# Altium schematic sheet EqualizerChannel.SchDoc
size A4; DocumentNumber: 1; SheetNumber: 1; SheetTotal: 4
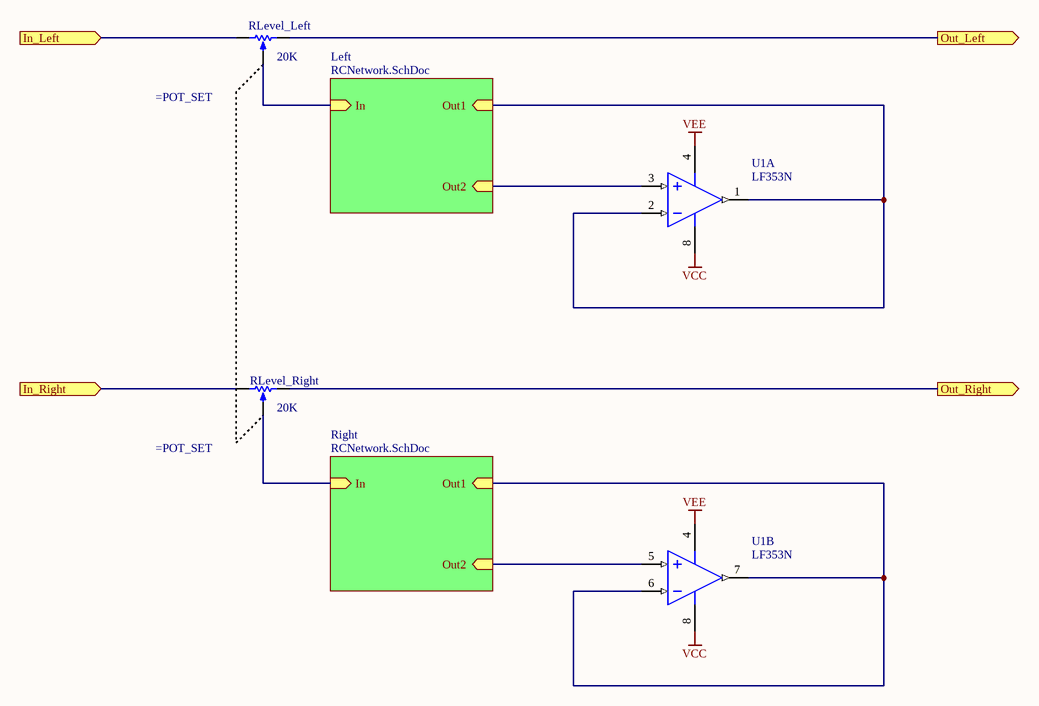
[diagram p0: EqualizerChannel.SchDoc]

## Parts
RLevel_Left  value 20K  [VR5]  (hidden comment: RPot)
RLevel_Right  value 20K  [VR5]  (hidden comment: RPot)
U1  LF353N  [N08E]  (parts A,B of 2)

## Sub-sheets
Left = RCNetwork.SchDoc: In (in), Out1 (in), Out2 (in)
Right = RCNetwork.SchDoc: In (in), Out1 (in), Out2 (in)

## Ports
In_Left (in), In_Right (in), Out_Left (out), Out_Right (out)

## Nets
VCC: U1.8(V+)
VEE: U1.4(V-)
In_Left: RLevel_Left.1(TOP) ; port In_Left
In_Right: RLevel_Right.1(TOP) ; port In_Right
Out_Left: RLevel_Left.2(BOT) ; port Out_Left
Out_Right: RLevel_Right.2(BOT) ; port Out_Right
NetRLevel_Left_3: RLevel_Left.3(TAP) ; sheet Left/In
NetRLevel_Right_3: RLevel_Right.3(TAP) ; sheet Right/In
NetU1_1: U1.1(OUTA) U1.2(INA-) ; sheet Left/Out1
NetU1_3: U1.3(INA+) ; sheet Left/Out2
NetU1_5: U1.5(INB+) ; sheet Right/Out2
NetU1_6: U1.6(INB-) U1.7(OUTB) ; sheet Right/Out1

## Notes on the sheet
- Title
- Size:
- Date:
- A4
- Number:
- Time:
- Revision:
- Sheet
- of
- File:

## Library data of the parts
RLevel_Left RLevel_Right = RPot: Potentiometer; Sim Note: Enter the Resistance value and the set point into parameter fields.; Published: 8-Jun-2000; LatestRevisionDate: 17-Jul-2002; LatestRevisionNote: Re-released for DXP Platform.; Publisher: Altium Limited; Set Position: =POT_SET
U1 = LF353N: Wide Bandwidth Dual JFET Input Operational Amplifier, 8-pin MDIP; Manufacturer: National Semiconductor; PackageTopMarking: NSUZXYTTE#*LF*353N; PowerWise: N; CompType: Amplifiers; Published: 4-Dec-2008; LatestRevisionDate: 13-Jan-2009; LatestRevisionNote: Sim Model Added.; PackageReference: N08E; Publisher: Altium Limited; ComponentLink1Description: LF353 Datasheet; ComponentLink1URL: http://www.national.com/ds/LF/LF353.pdf; ComponentLink2Description: LF353 Web Page; ComponentLink2URL: http://www.national.com/pf/LF/LF353.html; ComponentLink3Description: N08E Package Page; ComponentLink3URL: http://www.national.com/packaging/folders/n08e.html; DatasheetVersion: Dec-2003; PackageVersion: revG, May-2006; PackageDescription: MDIP, .365 x .250 x .130in, 8 Lead, .100in Pitch; Supplier 1: Farnell; Supplier Part Number 1: 9487034; PartNumber: LF353N; RoHS: N; PinCount: 8; Code_JEDEC: MS-001-BA